# Altium schematic sheet H_BRIDGE_Driver.SchDoc
size A
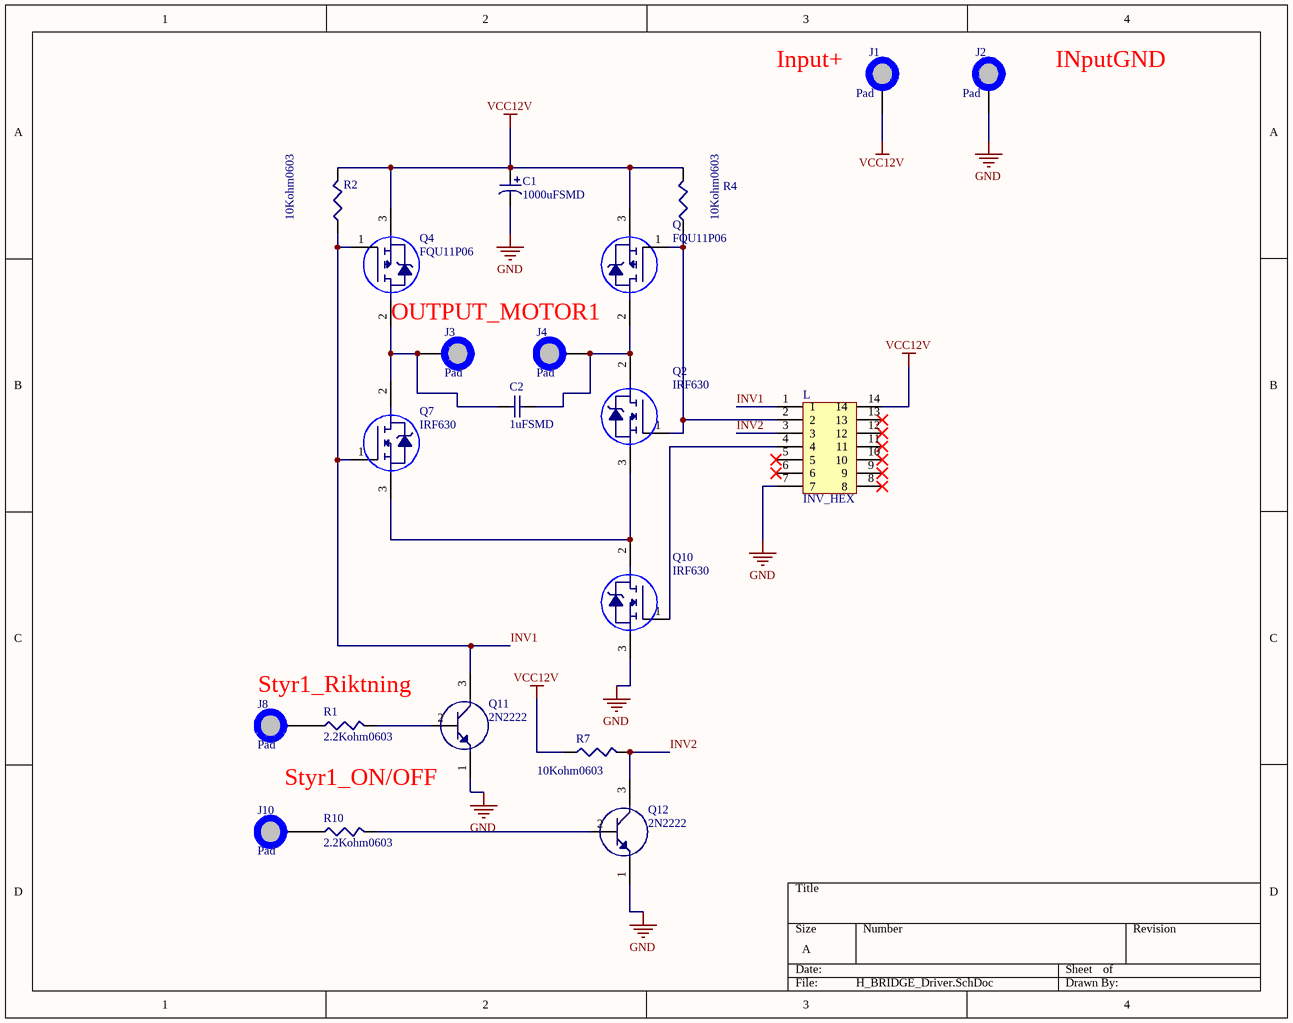
[diagram p0: H_BRIDGE_Driver.SchDoc]

## Parts
C1  1000uFSMD  [SMDaliminium-elektrolyt]
C2  1uFSMD  [C0805]
J1  Pad  [PAD_WITH_HOLE_4MMx1.5MM]
J2  Pad  [PAD_WITH_HOLE_4MMx1.5MM]
J3  Pad  [PAD_WITH_HOLE_4MMx1.5MM]
J4  Pad  [PAD_WITH_HOLE_4MMx1.5MM]
J8  Pad  [PAD_WITH_HOLE_4MMx1.5MM]
J10  Pad  [PAD_WITH_HOLE_4MMx1.5MM]
L  INV_HEX  [DIP14]
Q  FQU11P06  [I-PAK]
Q2  IRF630  [TO-220WithHeatSink]
Q4  FQU11P06  [I-PAK]
Q7  IRF630  [TO-220WithHeatSink]
Q10  IRF630  [TO-220WithHeatSink]
Q11  2N2222  [BJT2N2222]
Q12  2N2222  [BJT2N2222]
R1  2.2Kohm0603  [R0603]
R2  10Kohm0603  [R0603]
R4  10Kohm0603  [R0603]
R7  10Kohm0603  [R0603]
R10  2.2Kohm0603  [R0603]

## Nets
GND: C1.2 J2.1 L.7 Q10.3 Q11.1 Q12.1
VCC12V: C1.1 J1.1 L.14 Q.3 Q4.3 R2.2 R4.2 R7.1
INV1: L.1 Q4.1 Q7.1 Q11.3 R2.1
INV2: L.3 Q12.3 R7.2
NetC2_1: C2.1 J3.1 Q4.2 Q7.2
NetC2_2: C2.2 J4.1 Q.2 Q2.2
NetJ8_1: J8.1 R1.1
NetJ10_1: J10.1 R10.1
NetL_2: L.2 Q.1 Q2.1 R4.1
NetL_4: L.4 Q10.1
NetQ2_3: Q2.3 Q7.3 Q10.2
NetQ11_2: Q11.2 R1.2
NetQ12_2: Q12.2 R10.2

Not connected (* = marked no-connect by the designer): L 5* 6* 8* 9* 10* 11* 12* 13*

## Notes on the sheet
- (near J1) Input+
- INputGND
- (near Q4) OUTPUT_MOTOR1
- Styr1_Riktning
- Styr1_ON/OFF

## Library data of the parts
C1 = 865060462010: WURTH ELEKTRONIK         865060462010             SMD Aluminium Electrolytic Capacitor, Radial Can - SMD, 1000 F, 25 V, WCAP-ASLL Series; Manufacturer: Würth Elektronik (Wuerth Elektronik); Capacitance: 1000µF; Tolerance: ±20%; Voltage Rating: 25V; Lifetime @ Temp.: 5000 Hrs @ 105°C; Polarization: Polar; Ripple Current: 1.15A @ 100kHz; Impedance: 66 mOhm; Surface Mount Land Size: 0.531" L x 0.531" W (13.50mm x 13.50mm); Other Names: 732-8539-2; Supplier 1: Farnell; Manufacturer Part Number: 865060462010; Stock 1: 240; Pricing 1: 1=1.79, 3=1.63, 5=1.5, 10=1.3, 20=1.11, 50=0.964, 250=0.767, 500=0.683 (EUR); Standard Package: 200; Category: Capacitors; Family: Aluminum Capacitors; Series: WCAP-ASLL; Packaging: Tape &amp; Reel (TR); ESR (Equivalent Series Resistance): -; Operating Temperature: -55°C ~ 105°C; Applications: General Purpose; Lead Spacing: -; Size / Dimension: 0.492" Dia (12.50mm); Height - Seated (Max): 0.551" (14.00mm); Mounting Type: Surface Mount; Package / Case: Radial, Can - SMD; Online Catalog: WCAP-ASLL Series; ComponentLink1URL: http://www.farnell.com/datasheets/1880055.pdf; ComponentLink1Description: http://www.farnell.com/datasheets/1880055.pdf; ComponentLink2URL: http://katalog.we-online.de/pbs/datasheet/865060462010.pdf; ComponentLink2Description: http://katalog.we-online.de/pbs/datasheet/865060462010.pdf; Supplier Part Number 1: 2466212RL
C2 = 0805F105Z250CT: Cap Ceramic 1uF 25V Y5V -20% to 80% SMD 0805 85C Plastic T/R; Manufacturer: Walsin Technologies; Capacitance: 1000000 pF; Case Style: Ceramic Chip; Product Depth (mm): 1.25 mm; Product Diameter (mm): Not Required mm; Product Length (mm): 2 mm; Rad Hardened: No; Voltage: 25VDC; Wire Form: Not Required; Supplier 1: Farnell; Manufacturer Part Number: 0805F105Z250CT; Stock 1: 81660; Pricing 1: 10=0.0398, 100=0.0282, 250=0.0175, 750=0.0146, 1500=0.0109 (GBP); Construction: SMT Chip; Failure Rate: Not Required; Mounting Style: Surface Mount; Operating Temp Range: -25C to 85C; Package / Case: 0805; Packaging: Tape and Reel; Product Height (mm): 1.25 mm; Temp Coeff (Dielectric): Y5V; Tolerance (+ or -): -20% to 80%; ComponentLink1URL: https://datasheet.ciiva.com/26831/getdatasheetpartid-747373-26831419.pdf; ComponentLink1Description: https://datasheet.ciiva.com/26831/getdatasheetpartid-747373-26831419.pdf; Supplier Part Number 1: 2496996
J1-J4 J8 J10 = Hole
L = CD40106BE: IC, HEX INVERTER, 4000 CMOS, 16DIP; Manufacturer: Texas Instruments (TI); Logic Function: Inverter Schmitt Trigger; Logic Family: CD4000; Number of Elements per Chip: 6; Output Type: Schmitt Trigger; Maximum Low Level Output Current: 4.2(Min) mA; Maximum High Level Output Current: -4.2(Min) mA; Maximum Propagation Delay Time @ Maximum CL: 280@5V|140@10V|120@15V ns; Propagation Delay Test Condition: 50 pF; Typical Quiescent Current: 0.04 uA; Typical Operating Supply Voltage: 3.3|5|9|12|15 V; Rad Hard: No; Supplier 1: Farnell; Manufacturer Part Number: CD40106BE; Stock 1: 22628; Pricing 1: 1=0.49, 10=0.405, 100=0.22, 250=0.218, 500=0.217, 900=0.146, 3000=0.143, 9000=0.131 (EUR); Package: 14PDIP; Operating Temperature: -55 to 125 °C; Fabrication Technology: CMOS; Category: Inverter Schmitt Trigger; Packaging: Rail / Tube; Input Type: Schmitt Trigger; ComponentLink1URL: https://datasheet.ciiva.com/31393/83-0482-v1-31393479.pdf; ComponentLink1Description: https://datasheet.ciiva.com/31393/83-0482-v1-31393479.pdf; ComponentLink2URL: https://datasheet.ciiva.com/14134/cd40106b-eng-tds-14134554.pdf; ComponentLink2Description: https://datasheet.ciiva.com/14134/cd40106b-eng-tds-14134554.pdf; ComponentLink3URL: https://datasheet.ciiva.com/15089/getdatasheetpartid-83071-15089178.pdf; ComponentLink3Description: https://datasheet.ciiva.com/15089/getdatasheetpartid-83071-15089178.pdf; ComponentLink4URL: https://datasheet.ciiva.com/27050/893179-27050663.pdf; ComponentLink4Description: https://datasheet.ciiva.com/27050/893179-27050663.pdf; ComponentLink5URL: https://datasheet.ciiva.com/4827/schs097d-127287-4827216.pdf; ComponentLink5Description: https://datasheet.ciiva.com/4827/schs097d-127287-4827216.pdf; ComponentLink6URL: https://datasheet.ciiva.com/29138/174319-da-01-en-cmos-ic-cd-40106-be-dip14-tid-29138613.pdf; ComponentLink6Description: https://datasheet.ciiva.com/29138/174319-da-01-en-cmos-ic-cd-40106-be-dip14-tid-29138613.pdf; ComponentLink7URL: https://datasheet.ciiva.com/1626/1833362-1626124.pdf; ComponentLink7Description: https://datasheet.ciiva.com/1626/1833362-1626124.pdf; ComponentLink8URL: https://datasheet.ciiva.com/26228/cd40106b-mil-26228764.pdf; ComponentLink8Description: https://datasheet.ciiva.com/26228/cd40106b-mil-26228764.pdf; ComponentLink9URL: https://datasheet.ciiva.com/1508/1707951-1508125.pdf; ComponentLink9Description: https://datasheet.ciiva.com/1508/1707951-1508125.pdf; ComponentLink10URL: https://datasheet.ciiva.com/7783/1833362-7783095.pdf; ComponentLink10Description: https://datasheet.ciiva.com/7783/1833362-7783095.pdf; ComponentLink11URL: https://datasheet.ciiva.com/14290/cd40106b-mil-14290377.pdf; ComponentLink11Description: https://datasheet.ciiva.com/14290/cd40106b-mil-14290377.pdf; ComponentLink12URL: https://datasheet.ciiva.com/1866/cd40106b-1866363.pdf; ComponentLink12Description: https://datasheet.ciiva.com/1866/cd40106b-1866363.pdf; Supplier Part Number 1: 1106097
Q Q4 = FQU11P06: FAIRCHILD SEMICONDUCTOR         FQU11P06            MOSFET Transistor, P Channel, 9.4 A, 60 V, 185 mohm, -10 V, -4 V; Field-effect transistor type: Enhancement; Drain to Source voltage: 60V; Continuous drain current: 9.4A; Drain to Source on-state resistance: 185@10VmOhm; Supplier 1: Farnell; Manufacturer: Fairchild Semiconductor; Manufacturer Part Number: FQU11P06; Stock 1: 3144; Pricing 1: 1=0.814, 25=0.698, 100=0.548 (EUR); Package: IPAK; ComponentLink1URL: http://www.farnell.com/datasheets/1796811.pdf; ComponentLink1Description: http://www.farnell.com/datasheets/1796811.pdf; Supplier Part Number 1: 9846166
Q2 Q7 Q10 = IRF630: MOSFET N-CH 200V 9A TO-220; Manufacturer: STMicroelectronics; Transistor Polarity: N Channel; On Resistance Rds(on): 400mohm; Rds(on) Test Voltage Vgs: 10V; Threshold Voltage Vgs Typ: 3V; Power Dissipation Pd: 100W; No. of Pins: 3; SVHC: No SVHC (19-Dec-2012); Alternate Case Style: SOT-78B; Capacitance Ciss Typ: 540pF; Current Temperature: 25°C; No. of Transistors: 1; Pin Configuration: a; Pin Format: 1G, (2+Tab)D, 3S; Pulse Current Idm: 36A; Reverse Recovery Time trr Typ: 170ns; Voltage Vgs th Max: 4V; Voltage Vgs th Min: 2V; Supplier 1: Farnell; Manufacturer Part Number: IRF630; Stock 1: 245; Pricing 1: 1=1.17, 10=0.95, 100=0.73, 500=0.65, 1000=0.51, 5000=0.49 (EUR); Continuous Drain Current Id: 9A; Drain Source Voltage Vds: 200V; Operating Temperature Min: -65°C; Operating Temperature Max: 150°C; Transistor Case Style: TO-220; MSL: (Not Applicable); Current Id Max: 9A; Full Power Rating Temperature: 25°C; Lead Spacing: 2.54mm; On State resistance @ Vgs = 10V: 400mohm; Operating Temperature Range: -65°C to +150°C; Package / Case: TO-220; Voltage Vds Typ: 200V; Voltage Vgs Max: 3V; Voltage Vgs Rds on Measurement: 10V; ComponentLink1URL: https://datasheet.ciiva.com/27746/47-0290-27746871.pdf; ComponentLink1Description: https://datasheet.ciiva.com/27746/47-0290-27746871.pdf; ComponentLink2URL: https://datasheet.ciiva.com/29324/155772-da-01-en-mosfet-irf630-stm-29324203.pdf; ComponentLink2Description: https://datasheet.ciiva.com/29324/155772-da-01-en-mosfet-irf630-stm-29324203.pdf; ComponentLink3URL: https://datasheet.ciiva.com/15193/getdatasheetpartid-84724-15193131.pdf; ComponentLink3Description: https://datasheet.ciiva.com/15193/getdatasheetpartid-84724-15193131.pdf; ComponentLink4URL: https://datasheet.ciiva.com/16290/cd00000701-16290285.pdf; ComponentLink4Description: https://datasheet.ciiva.com/16290/cd00000701-16290285.pdf; ComponentLink5URL: https://datasheet.ciiva.com/938/cd00000701-938548.pdf; ComponentLink5Description: https://datasheet.ciiva.com/938/cd00000701-938548.pdf; ComponentLink6URL: https://datasheet.ciiva.com/7643/1689784-7643063.pdf; ComponentLink6Description: https://datasheet.ciiva.com/7643/1689784-7643063.pdf; ComponentLink7URL: https://datasheet.ciiva.com/46382/1689784-46382250.pdf; ComponentLink7Description: https://datasheet.ciiva.com/46382/1689784-46382250.pdf; Supplier Part Number 1: 2144993
Q11 Q12 = 2N2222: MULTICOMP         2N2222             Bipolar (BJT) Single Transistor, NPN, 30 V, 500 mW, 800 mA, 100 hFE; Collector Emitter Voltage V(br)ceo: 30V; Power Dissipation Pd: 500mW; DC Collector Current: 800mA; DC Current Gain hFE: 100; Transistor Case Style: TO-18; No. of Pins: 3; SVHC: No SVHC (19-Dec-2012); Collector Emitter Voltage Vces: 400mV; Current Ic @ Vce Sat: 150mA; Full Power Rating Temperature: 25°C; Gain Bandwidth ft Min: 250MHz; No. of Transistors: 1; Pin Configuration: a; Voltage Vcbo: 60V; Supplier 1: Farnell; Manufacturer: Multicomp; Manufacturer Part Number: 2N2222; Stock 1: 79208; Pricing 1: 1=1.45, 25=0.795, 100=0.737, 500=0.293, 1000=0.214, 2000=0.189, 7000=0.187, 20000=0.185 (EUR); Transistor Polarity: NPN; Continuous Collector Current Ic Max: 800mA; Current Ic Continuous a Max: 800mA; Current Ic hFE: 150mA; Gain Bandwidth ft Typ: 250MHz; Hfe Min: 100; Package / Case: TO-18; Power Dissipation Ptot Max: 500mW; ComponentLink1URL: https://datasheet.ciiva.com/1400/1524377-1400202.pdf; ComponentLink1Description: https://datasheet.ciiva.com/1400/1524377-1400202.pdf; ComponentLink2URL: https://datasheet.ciiva.com/1259/296640-1259843.pdf; ComponentLink2Description: https://datasheet.ciiva.com/1259/296640-1259843.pdf; ComponentLink3URL: https://datasheet.ciiva.com/1194/1662272-1194081.pdf; ComponentLink3Description: https://datasheet.ciiva.com/1194/1662272-1194081.pdf; Supplier Part Number 1: 9206884
R1 R10 = RC0603FR-072K2L: RES SMD 2.2K OHM 1% 1/10W 0603; Manufacturer: Yageo; Resistance: 2.2 kOhms; Power Rating: 100 mW; Voltage Rating: 50 V; Temperature Coefficient: 100 PPM / C; Supplier 1: Farnell; Manufacturer Part Number: RC0603FR-072K2L; Stock 1: 73325; Pricing 1: 10=0.0079, 300=0.0068, 500=0.0059, 1250=0.0048, 2500=0.004 (EUR); Termination Style: SMD/SMT; Product: Thick Film Resistors General Purpose; Tolerance: 1 %; Case Code - in: 0603; Case Code - mm: 1608; Series: RC; Operating Temperature Range: - 55 C to + 155 C; Packaging: Reel; ComponentLink1URL: https://datasheet.ciiva.com/7746/1738695-7746315.pdf; ComponentLink1Description: https://datasheet.ciiva.com/7746/1738695-7746315.pdf; ComponentLink2URL: https://datasheet.ciiva.com/2453/pyu-r-int-thick-7-2453945.pdf; ComponentLink2Description: https://datasheet.ciiva.com/2453/pyu-r-int-thick-7-2453945.pdf; ComponentLink3URL: https://datasheet.ciiva.com/46394/443971-46394958.pdf; ComponentLink3Description: https://datasheet.ciiva.com/46394/443971-46394958.pdf; ComponentLink4URL: https://datasheet.ciiva.com/7746/1738695-7746316.pdf; ComponentLink4Description: https://datasheet.ciiva.com/7746/1738695-7746316.pdf; ComponentLink5URL: https://datasheet.ciiva.com/2453/pyu-r-int-thick-7-2453943.pdf; ComponentLink5Description: https://datasheet.ciiva.com/2453/pyu-r-int-thick-7-2453943.pdf; ComponentLink6URL: https://datasheet.ciiva.com/46440/1868787-46440902.pdf; ComponentLink6Description: https://datasheet.ciiva.com/46440/1868787-46440902.pdf; ComponentLink7URL: https://datasheet.ciiva.com/2453/pyu-r-int-thick-7-2453944.pdf; ComponentLink7Description: https://datasheet.ciiva.com/2453/pyu-r-int-thick-7-2453944.pdf; ComponentLink8URL: https://datasheet.ciiva.com/7660/1868787-7660791.pdf; ComponentLink8Description: https://datasheet.ciiva.com/7660/1868787-7660791.pdf; Supplier Part Number 1: 9238522
R2 R4 R7 = RC0603FR-0710KL: YAGEO         RC0603FR-0710KL             RES, THICK FILM, 10K, 1%, 0.1W, 0603; Resistance: 10 kOhms; Power Rating: 100 mW; Temperature Coefficient: 100 PPM / C; Voltage Rating: 75 V; Unit Weight: 0.000071 oz; Supplier 1: Farnell; Manufacturer: Yageo; Manufacturer Part Number: RC0603FR-0710KL; Stock 1: 328031; Pricing 1: 10=0.0082, 300=0.007, 500=0.0061, 1250=0.0049, 2500=0.0041 (EUR); Product Category: Thick Film Resistors; RoHS: True; Brand: Yageo; Tolerance: 1 %; Case Code - in: 0603; Case Code - mm: 1608; Operating Temperature Range: - 55 C to + 155 C; Series: RC; Height: 0.45 mm; Length: 1.6 mm; Package / Case: 0603 (1608 metric); Packaging: Reel; Product: Thick Film Resistors General Purpose; Termination Style: SMD/SMT; Type: General Purpose Chip Resistor Surface Mount; Width: 0.8 mm; ComponentLink1URL: https://datasheet.ciiva.com/7983/443971-7983596.pdf; ComponentLink1Description: https://datasheet.ciiva.com/7983/443971-7983596.pdf; ComponentLink2URL: https://datasheet.ciiva.com/7746/1738695-7746239.pdf; ComponentLink2Description: https://datasheet.ciiva.com/7746/1738695-7746239.pdf; ComponentLink3URL: https://datasheet.ciiva.com/22747/443971-22747519.pdf; ComponentLink3Description: https://datasheet.ciiva.com/22747/443971-22747519.pdf; ComponentLink4URL: https://datasheet.ciiva.com/7660/38590-7660789.pdf; ComponentLink4Description: https://datasheet.ciiva.com/7660/38590-7660789.pdf; ComponentLink5URL: https://datasheet.ciiva.com/15189/getdatasheetpartid-409289-15189591.pdf; ComponentLink5Description: https://datasheet.ciiva.com/15189/getdatasheetpartid-409289-15189591.pdf; ComponentLink6URL: https://datasheet.ciiva.com/46440/1868787-46440891.pdf; ComponentLink6Description: https://datasheet.ciiva.com/46440/1868787-46440891.pdf; Supplier Part Number 1: 9238603